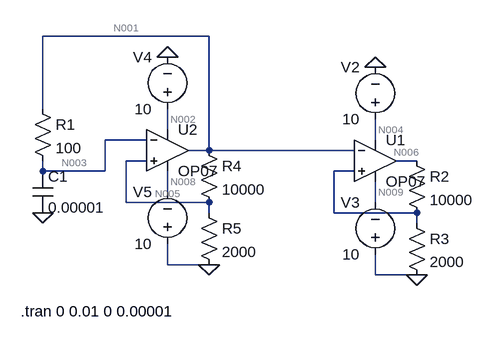
[diagram p0: schematic Astable_Multivibrator.asc]
Astable_Multivibrator.asc, the LTspice schematic file:
Version 4
SHEET 1 880 680
WIRE 0 -32 -256 -32
WIRE -256 80 -256 -32
WIRE -64 112 -64 80
WIRE -96 128 -160 128
WIRE 256 128 256 96
WIRE 0 144 0 -32
WIRE 0 144 -32 144
WIRE 224 144 0 144
WIRE -96 160 -128 160
WIRE 320 160 288 160
WIRE -256 176 -256 160
WIRE -160 176 -160 128
WIRE -160 176 -256 176
WIRE 224 176 192 176
WIRE -64 208 -64 176
WIRE -128 224 -128 160
WIRE 0 224 -128 224
WIRE 256 224 256 192
WIRE 0 240 0 224
WIRE 192 240 192 176
WIRE 320 240 192 240
WIRE 320 256 320 240
WIRE -64 320 -64 288
WIRE 0 320 -64 320
WIRE 256 336 256 304
WIRE 320 336 256 336
FLAG 0 320 0
FLAG -64 0 0
FLAG -256 240 0
FLAG 320 336 0
FLAG 256 16 0
SYMBOL res -16 128 R0
SYMATTR InstName R4
SYMATTR Value 10000
SYMBOL res -16 224 R0
SYMATTR InstName R5
SYMATTR Value 2000
SYMBOL Opamps\\OP07 -64 80 R0
SYMATTR InstName U2
SYMBOL voltage -64 96 R180
WINDOW 0 24 96 Left 2
WINDOW 3 24 16 Left 2
WINDOW 123 0 0 Left 2
WINDOW 39 0 0 Left 2
SYMATTR InstName V4
SYMATTR Value 10
SYMBOL voltage -64 304 R180
WINDOW 0 24 96 Left 2
WINDOW 3 24 16 Left 2
WINDOW 123 0 0 Left 2
WINDOW 39 0 0 Left 2
SYMATTR InstName V5
SYMATTR Value 10
SYMBOL res -272 64 R0
SYMATTR InstName R1
SYMATTR Value 100
SYMBOL cap -272 176 R0
SYMATTR InstName C1
SYMATTR Value 0.00001
SYMBOL res 304 144 R0
SYMATTR InstName R2
SYMATTR Value 10000
SYMBOL res 304 240 R0
SYMATTR InstName R3
SYMATTR Value 2000
SYMBOL Opamps\\OP07 256 96 R0
SYMATTR InstName U1
SYMBOL voltage 256 112 R180
WINDOW 0 24 96 Left 2
WINDOW 3 24 16 Left 2
WINDOW 123 0 0 Left 2
WINDOW 39 0 0 Left 2
SYMATTR InstName V2
SYMATTR Value 10
SYMBOL voltage 256 320 R180
WINDOW 0 24 96 Left 2
WINDOW 3 24 16 Left 2
WINDOW 123 0 0 Left 2
WINDOW 39 0 0 Left 2
SYMATTR InstName V3
SYMATTR Value 10
TEXT -290 392 Left 2 !.tran 0 0.01 0 0.00001

The netlist it stands for:
* Astable_Multivibrator.asc
R4 N001 N005 10000
R5 N005 0 2000
XU2 N005 N003 N002 N008 N001 LT1001  ; OP07, pins In+ In- V+ V- OUT
V4 N002 0 10
V5 0 N008 10
R1 N001 N003 100
C1 N003 0 0.00001
R2 N006 N007 10000
R3 N007 0 2000
XU1 N007 N001 N004 N009 N006 LT1001  ; OP07, pins In+ In- V+ V- OUT
V2 N004 0 10
V3 0 N009 10
.tran 0 0.01 0 0.00001
.lib LTC.lib
.backanno
.end

* Results of the author's LTspice run, read from the files saved beside the schematic
* Operating Point, zero values left out:
*   V(n002) = 10 V
*   V(n008) = -10 V
*   V(n004) = 10 V
*   V(n009) = -10 V
*   I(V3) = -2.25 mA
*   I(V2) = -2.25 mA
*   I(V5) = -2.25 mA
*   I(V4) = -2.25 mA
*   Ix(u2:3) = 2.25 mA
*   Ix(u2:4) = -2.25 mA
*   Ix(u1:3) = 2.25 mA
*   Ix(u1:4) = -2.25 mA
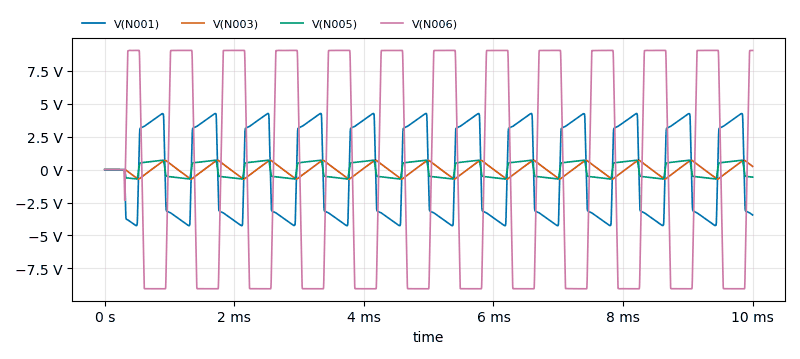
[diagram p1: Transient Analysis of Astable_Multivibrator.asc, plotted from the saved traces]
* Transient Analysis, 1 run:
*   V(N001): min -4.256 V, max 4.259 V, average 23.61 mV, rms 3.534 V, last -3.442 V
*   V(N003): min -712 mV, max 711.5 mV, average -777.9 µV, rms 446.5 mV, last 243.3 mV
*   V(N005): min -709.3 mV, max 709.8 mV, average 3.936 mV, rms 587.9 mV, last -573.7 mV
*   V(N006): min -9.044 V, max 9.045 V, average -82.88 mV, rms 8.333 V, last 9.036 V